# EAGLE design PulseOxi (EAGLE 9.6.2)
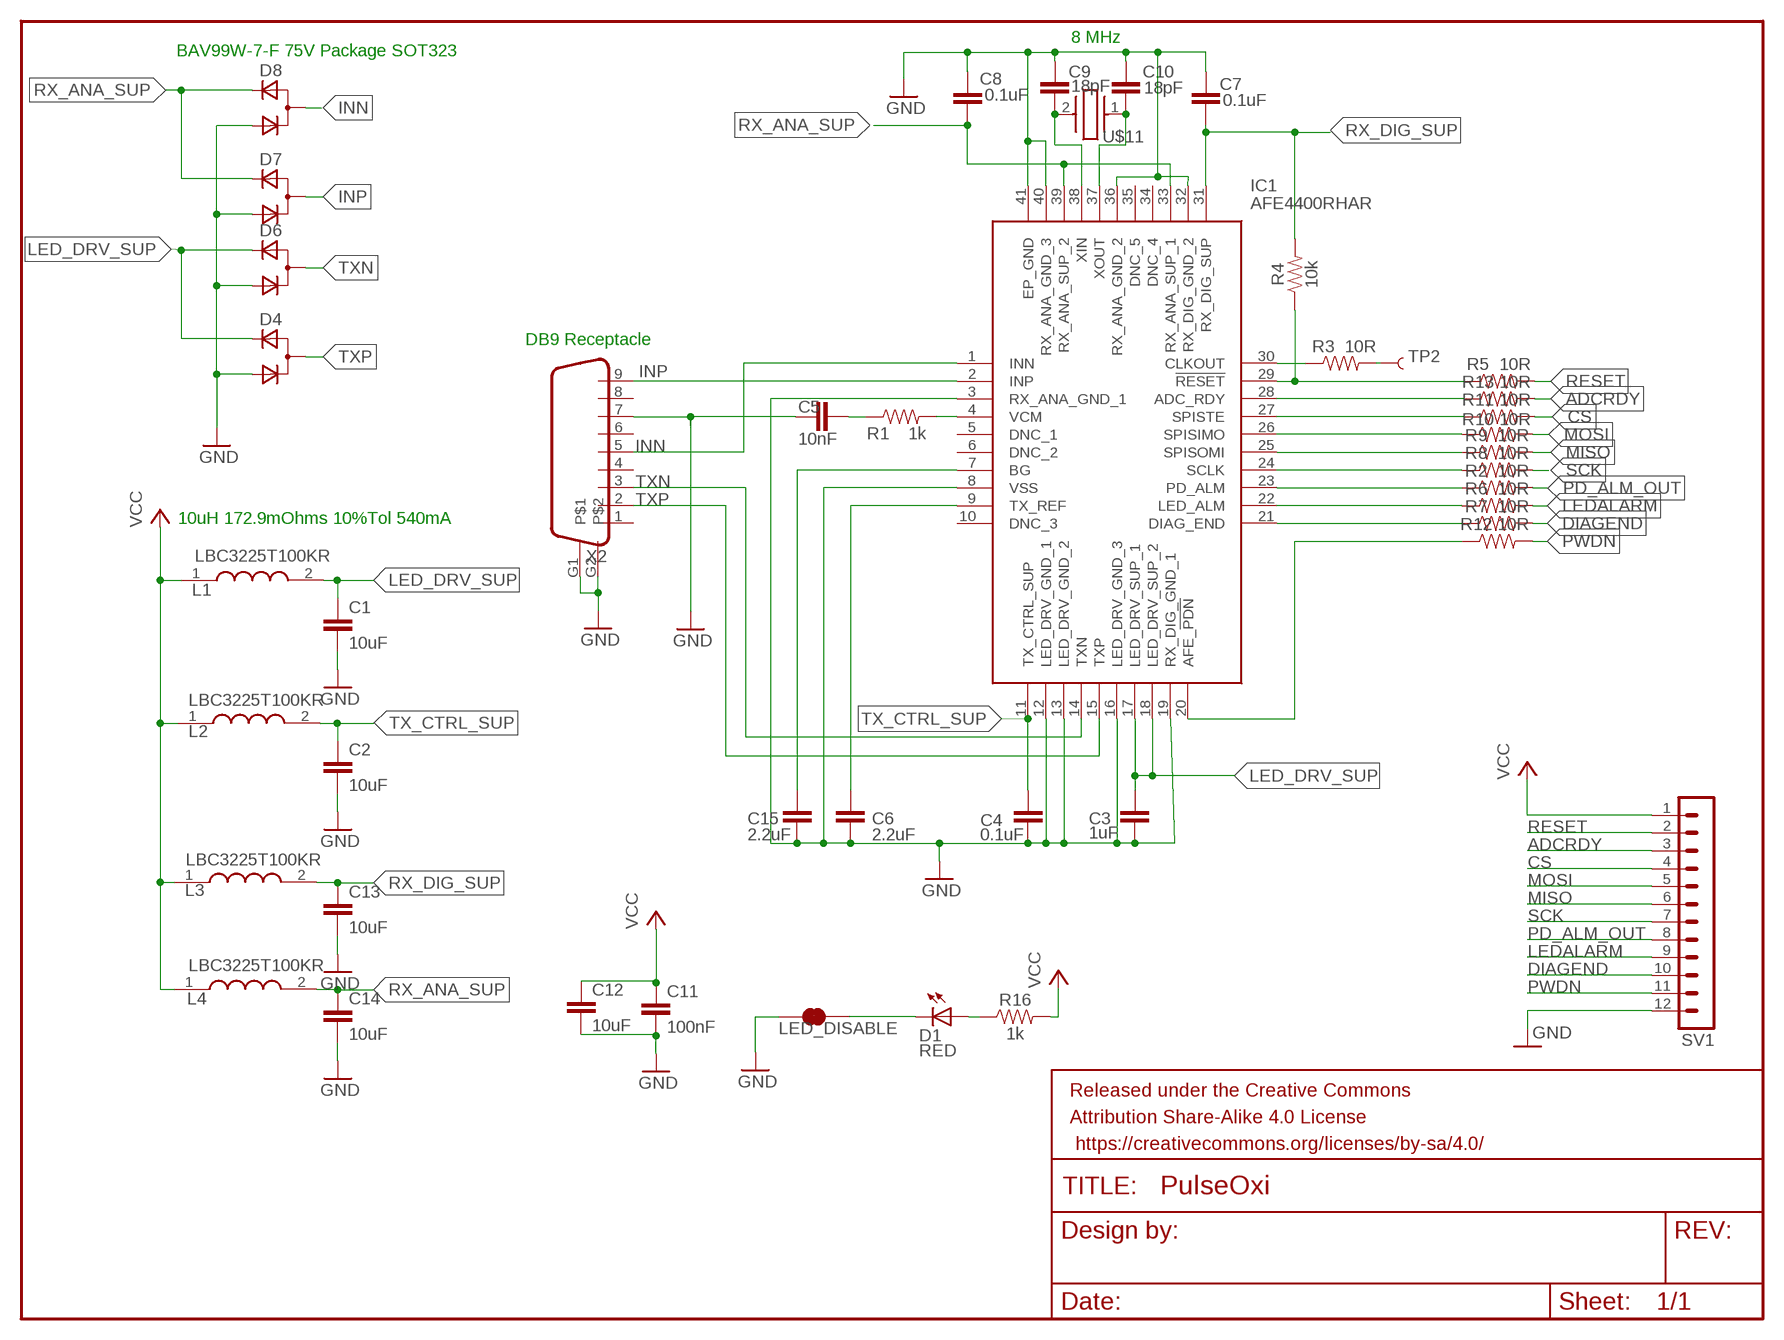
[diagram p0: schematic, sheet 1]

## Parts
C1  10uF  27PF-0603-50V-5%  [0603]
C2  10uF  27PF-0603-50V-5%  [0603]
C3  1uF  27PF-0603-50V-5%  [0603]
C4  0.1uF  27PF-0603-50V-5%  [0603]
C5  10nF  10NF-0603-50V-10%  [0603]
C6  2.2uF  27PF-0603-50V-5%  [0603]
C7  0.1uF  27PF-0603-50V-5%  [0603]
C8  0.1uF  27PF-0603-50V-5%  [0603]
C9  18pF  18PF-0603-50V-5%  [0603]
C10  18pF  18PF-0603-50V-5%  [0603]
C11  100nF  27PF-0603-50V-5%  [0603]
C12  10uF  27PF-0603-50V-5%  [0603]
C13  10uF  27PF-0603-50V-5%  [0603]
C14  10uF  27PF-0603-50V-5%  [0603]
C15  2.2uF  27PF-0603-50V-5%  [0603]
D1  RED  LED-RED0603  [LED-0603]
D4  D_ACACSOT323  [SOT323]
D6  D_ACACSOT323  [SOT323]
D7  D_ACACSOT323  [SOT323]
D8  D_ACACSOT323  [SOT323]
FRAME1  FRAME-LETTERNO_PACKAGE  [DUMMY]
IC1  AFE4400RHAR  [QFN50P600X600X100-41N]
L1  LBC3225T100KR  [INDC3225X270N]
L2  LBC3225T100KR  [INDC3225X270N]
L3  LBC3225T100KR  [INDC3225X270N]
L4  LBC3225T100KR  [INDC3225X270N]
LED_DISABLE  JUMPER-SMT_2_NC_TRACE_SILK  [SMT-JUMPER_2_NC_TRACE_SILK]
R1  1k  1KOHM-0603-1/10W-1%  [0603]
R2  10R  1.8MOHM  [0603]
R3  10R  1.8MOHM  [0603]
R4  10k  1.8MOHM  [0603]
R5  10R  1.8MOHM  [0603]
R6  10R  1.8MOHM  [0603]
R7  10R  1.8MOHM  [0603]
R8  10R  1.8MOHM  [0603]
R9  10R  1.8MOHM  [0603]
R10  10R  1.8MOHM  [0603]
R11  10R  1.8MOHM  [0603]
R12  10R  1.8MOHM  [0603]
R13  10R  1.8MOHM  [0603]
R16  1k  1KOHM-0603-1/10W-1%  [0603]
SV1  MA12-1  [MA12-1]
TP2  TEST-POINT3  [PAD.03X.03]
U$11  ABM3-8.000MHZ-D2Y-T  [ABM3]
X2  DB9  [DB9]

## Nets
ADCRDY: R13.2 SV1.3
AFE_PWDN: IC1.20(AFE_!PDN) R12.1
CS: R11.2 SV1.4
DIAGEND: R7.2 SV1.10
GND: C1.2 C2.2 C3.2 C4.2 C5.2 C6.2 C7.2 C8.2 C9.2 C10.2 C11.2 C12.2 C13.2 C14.2 C15.2 D4.2(C) D6.2(C) D7.2(C) D8.2(C) IC1.3(RX_ANA_GND_1) IC1.8(VSS) IC1.12(LED_DRV_GND_1) IC1.13(LED_DRV_GND_2) IC1.16(LED_DRV_GND_3) IC1.19(RX_DIG_GND_1) IC1.32(RX_DIG_GND_2) IC1.36(RX_ANA_GND_2) IC1.40(RX_ANA_GND_3) IC1.41(EP_GND) LED_DISABLE.1 SV1.12 X2.7 X2.G1 X2.G2
INN: D8.1(CA) IC1.1(INN) X2.5
INP: D7.1(CA) IC1.2(INP) X2.9
LED_DRV_SUP: C1.1 C3.1 D4.3(A) D6.3(A) IC1.17(LED_DRV_SUP_1) IC1.18(LED_DRV_SUP_2) L1.2
LEDALARM: R6.2 SV1.9
MISO: R9.2 SV1.6
MOSI: R10.2 SV1.5
N$1: R3.2 TP2.P$1
N$2: IC1.30(CLKOUT) R3.1
N$4: IC1.29(!RESET) R4.1 R5.1
N$5: C15.1 IC1.7(BG)
N$6: C5.1 R1.1
N$7: C6.1 IC1.9(TX_REF)
N$8: IC1.28(ADC_RDY) R13.1
N$9: IC1.21(DIAG_END) R7.1
N$10: IC1.22(LED_ALM) R6.1
N$11: IC1.23(PD_ALM) R2.1
N$12: IC1.24(SCLK) R8.1
N$13: IC1.25(SPISOMI) R9.1
N$14: IC1.26(SPISIMO) R10.1
N$15: IC1.27(SPISTE) R11.1
N$16: C9.1 IC1.38(XIN) U$11.2
N$17: IC1.4(VCM) R1.2
N$19: C10.1 IC1.37(XOUT) U$11.1
N$26: D1.A R16.1
N$28: D1.C LED_DISABLE.2
PD_ALM_OUT: R2.2 SV1.8
PWDN: R12.2 SV1.11
RESET: R5.2 SV1.2
RX_ANA_SUP: C8.1 C14.1 D7.3(A) D8.3(A) IC1.33(RX_ANA_SUP_1) IC1.39(RX_ANA_SUP_2) L4.2
RX_DIG_SUP: C7.1 C13.1 IC1.31(RX_DIG_SUP) L3.2 R4.2
SCK: R8.2 SV1.7
TX_CTRL_SUP: C2.1 C4.1 IC1.11(TX_CTRL_SUP) L2.2
TXN: D6.1(CA) IC1.14(TXN) X2.3
TXP: D4.1(CA) IC1.15(TXP) X2.2
VCC: C11.1 C12.1 L1.1 L2.1 L3.1 L4.1 R16.2 SV1.1
Unconnected: IC1.5(DNC_1) IC1.6(DNC_2) IC1.10(DNC_3) IC1.34(DNC_4) IC1.35(DNC_5) X2.1 X2.4 X2.6 X2.8

## Notes on the sheet
- 8 MHz
- BAV99W-7-F 75V Package SOT323
- DB9 Receptacle
- 10uH 172.9mOhms 10%Tol 540mA

## Library data of the parts
C1-C4 C6-C8 C11-C15 = SparkFun-Capacitors:27PF: 27pF ceramic capacitors A capacitor is a passive two-terminal electrical component used to store electrical energy temporarily in an electric field.; PROD_ID: CAP-09989; VALUE: 27pF
C5 = SparkFun-Capacitors:10NF: 0.01uF/10nF/10,000pF ceramic capacitors A capacitor is a passive two-terminal electrical component used to store electrical energy temporarily in an electric field. CAP-09321; PROD_ID: CAP-00867
C9 C10 = SparkFun-Capacitors:18PF: 18pF ceramic capacitors A capacitor is a passive two-terminal electrical component used to store electrical energy temporarily in an electric field.; PROD_ID: CAP-08267
D1 = SparkFun-LED:LED-RED: Assorted Red LEDs LilyPad 1206- DIO-09912 1206- DIO-00809 0603- DIO-00819; PROD_ID: DIO-00819
D4 D6-D8 = zetex:D_ACAC: Dual DIODE; OC_FARNELL: unknown; OC_NEWARK: unknown
FRAME1 = SparkFun-Aesthetics:FRAME-LETTER: Schematic Frame - Letter Standard 8.5x11 US Letter frame; DESIGNER: Nobody; VERSION: v01
IC1 = AFE4400RHAR:AFE4400RHAR: Integrated Analog Front End (AFE) for Heart-Rate Monitors and Low-Cost Pulse Oximeters Source: Datasheet <http://www.ti.com/lit/ds/symlink/afe4400.pdf>; DESCRIPTION: Integrated Analog Front End (AFE) for Heart-Rate Monitors and Low-Cost Pulse Oximeters; HEIGHT: 1mm; MANUFACTURER_NAME: Texas Instruments; MANUFACTURER_PART_NUMBER: AFE4400RHAR; MOUSER_PART_NUMBER: 595-AFE4400RHAR; MOUSER_PRICE-STOCK: https://www.mouser.co.uk/ProductDetail/Texas-Instruments/AFE4400RHAR?qs=MURVExHfc2zl%2FM9SqCv0pw%3D%3D
L1-L4 = LBC3225T100KR:LBC3225T100KR: TAIYO YUDEN - LBC3225T100KR - INDUCTOR, 10UH, 540MA, 10%, 23MHz Source: Datasheet <https://ds.yuden.co.jp/TYCOMPAS/ut/detail?pn=LBC3225T100KR &u=M>; DESCRIPTION: TAIYO YUDEN - LBC3225T100KR - INDUCTOR, 10UH, 540MA, 10%, 23MHz; HEIGHT: 2.7mm; MANUFACTURER_NAME: TAIYO YUDEN; MANUFACTURER_PART_NUMBER: LBC3225T100KR; MOUSER_PART_NUMBER: 963-LBC3225T100KR; MOUSER_PRICE-STOCK: https://www.mouser.co.uk/ProductDetail/TAIYO-YUDEN/LBC3225T100KR?qs=PzICbMaShUfZVMW%252BOICEZw%3D%3D
LED_DISABLE = SparkFun-Jumpers:JUMPER-SMT_2_NC_TRACE: Normally closed trace jumper This jumper has a trace between two pads so it's normally closed (NC). Use a razor knife to open the connection. For best results follow the IPC guidelines for cutting traces: Cutout at least 0.063 mm (0.005 in). Remove all loose material to clean up the cut area. Seal the cut with an approved epoxy. Reapply solder to reclose the connection.
R1 R16 = SparkFun-Resistors:1KOHM: 1kΩ resistor A resistor is a passive two-terminal electrical component that implements electrical resistance as a circuit element. Resistors act to reduce current flow, and, at the same time, act to lower voltage levels within circuits. - Wikipedia; PROD_ID: RES-07856
R2-R13 = SparkFun-Resistors:1.8MOHM: 1.8 MOhms ±5% 0.1W, 1/10W Chip Resistor 0603; PROD_ID: RES-13994; VALUE: 1.8M
SV1 = con-lstb:MA12-1: PIN HEADER; OC_FARNELL: unknown; OC_NEWARK: unknown
TP2 = SparkFun:TEST-POINT
U$11 = ABM3-8.000MHZ-D2Y-T:ABM3-8.000MHZ-D2Y-T: MEMS Crystal Oscillator 66.666MHz +/-50ppm 4-Pin SMD Bulk Source: Datasheet <https://abracon.com/Resonators/abm3.pdf>; DESCRIPTION: MEMS Crystal Oscillator 66.666MHz +/-50ppm 4-Pin SMD Bulk; HEIGHT: 1.3mm; MANUFACTURER_NAME: ABRACON; MANUFACTURER_PART_NUMBER: ABM3-8.000MHZ-D2Y-T; MOUSER_PART_NUMBER: 815-ABM3-8-D2Y-T; MOUSER_PRICE-STOCK: https://www.mouser.co.uk/ProductDetail/ABRACON/ABM3-8.000MHZ-D2Y-T?qs=ihRgKfnEsN4giUXjc3yS1g%3D%3D
X2 = circuitects:DB9: DB9 Connector Standard DB9 (D-Sub 9) serial connector. Can be used for CAN bus as well as RS485 and RS232. Footprint production proven. Spark Fun Electronics SKU : PRT-00429

## Board
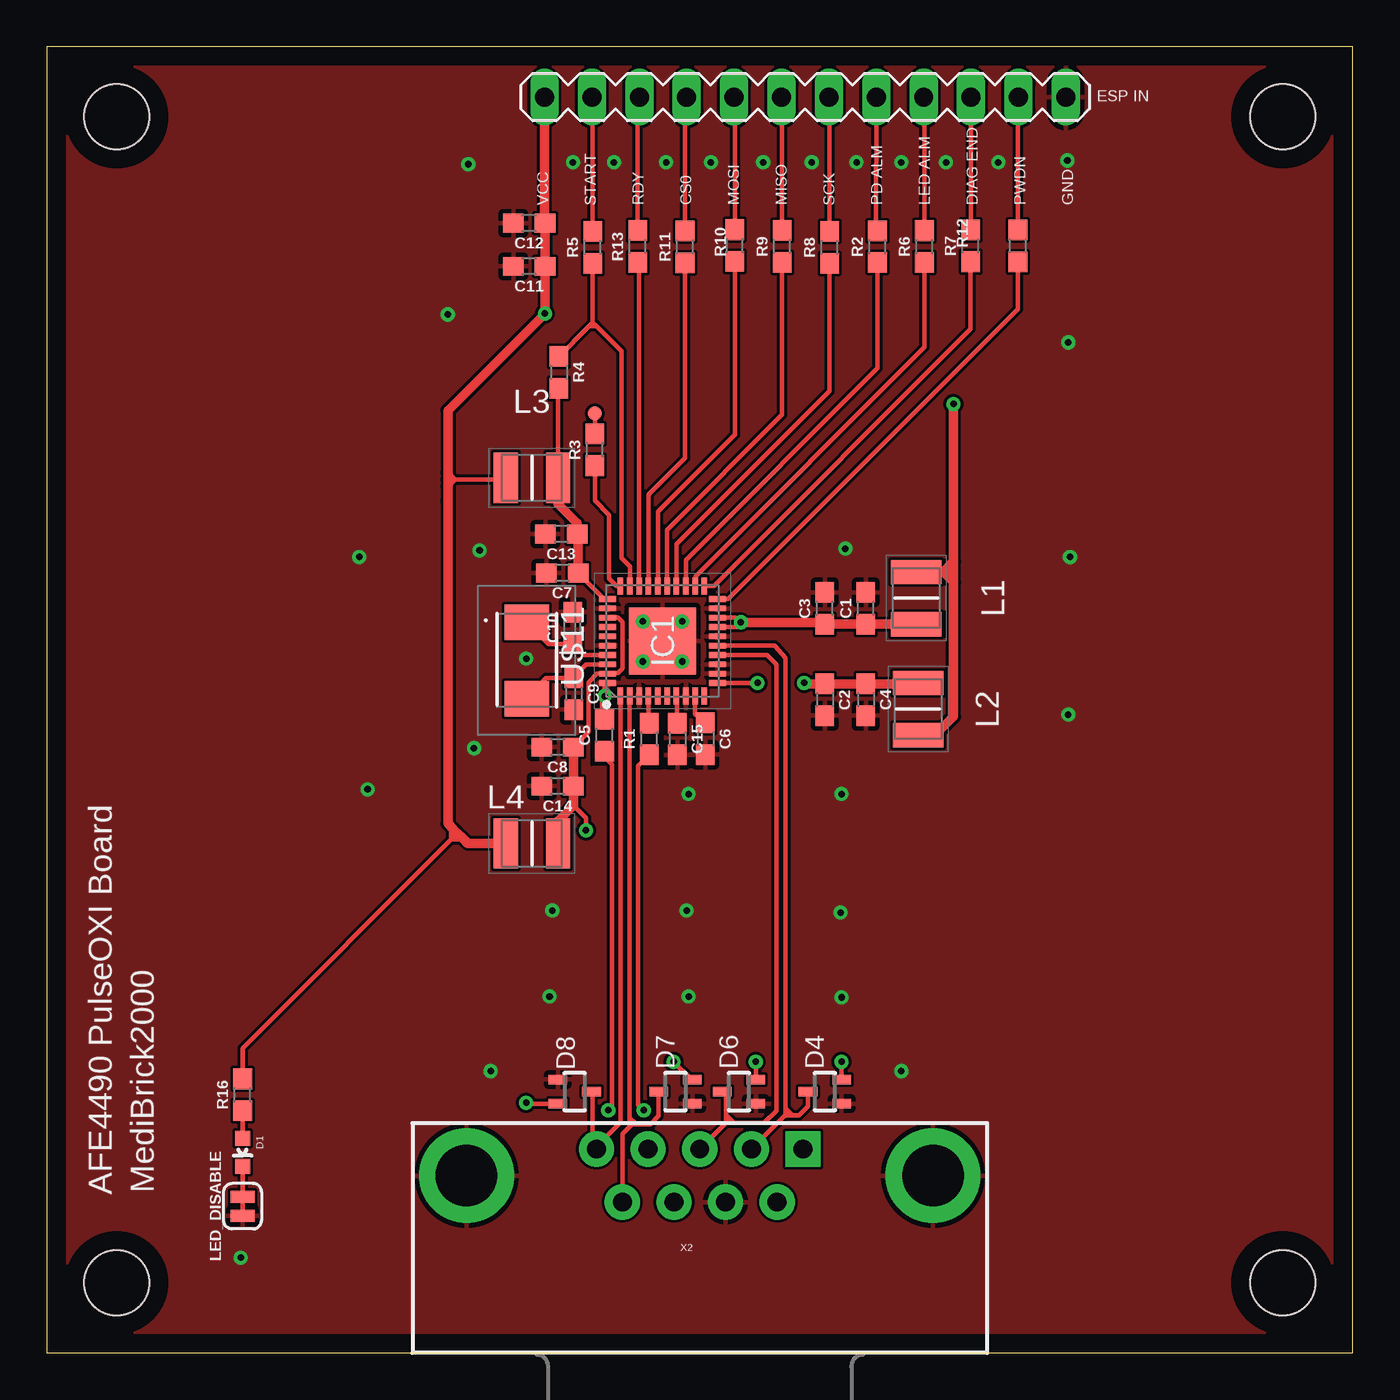
[diagram p1: board, top side]
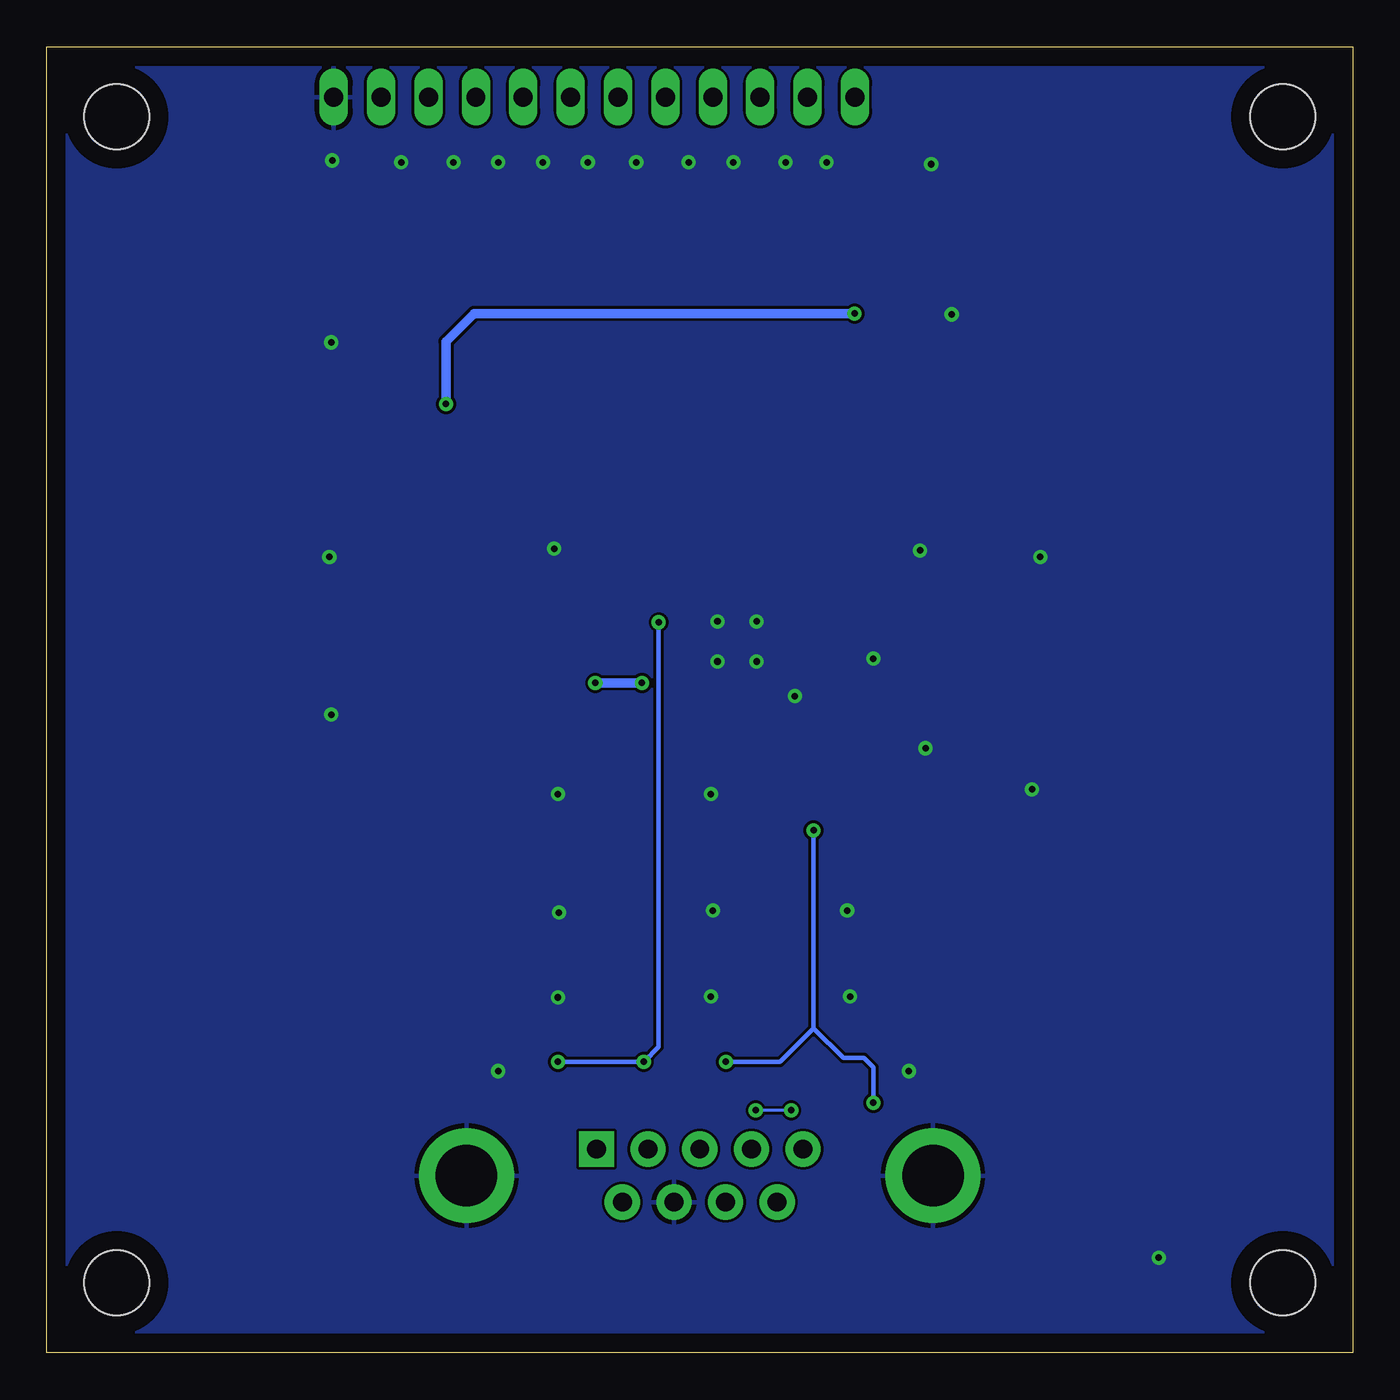
[diagram p2: board, bottom side, seen from below]

Size 70 x 70 mm. Coordinates in mm from the lower left corner, seen from the top.
Outline: 0,0 70,0 70,70 0,70 0,0
Copper layers (1*16): Top 0.035mm / dielectric 1.5mm / Bottom 0.035mm
Design rules "default": minimum track width 6mil, minimum drill 0.35mm, track to track 6mil, track to pad 6mil, pad to pad 6mil, via to via 6mil, smd to smd 6mil, copper to edge 40mil, drill to drill 6mil, minimum pad ring 10mil, minimum via ring 8mil, stop-mask expansion 4mil, vias tented up to drill 0mil, thermal gap 10mil
Holes 3.5 mm at 3.75,66.25 66.25,66.25 3.75,3.75 66.25,3.75

### Footprints (pad centres in the part's own frame; a part is rotated, then mirrored left to right if it is on the bottom)
0603 = smd 1.1 x 1: 1 -0.85,0; 2 0.85,0
LED-0603 = smd 0.8 x 0.8: A 0,-0.75; C 0,0.75
SOT323 = smd 0.5 x 1: 1 0,0.9; 2 -0.65,-0.9; 3 0.65,-0.9
QFN50P600X600X100-41N = smd 0.9 x 0.3: 1 -2.95,2.25; 2 -2.95,1.75; 3 -2.95,1.25; 4 -2.95,0.75; 5 -2.95,0.25; 6 -2.95,-0.25; 7 -2.95,-0.75; 8 -2.95,-1.25; 9 -2.95,-1.75; 10 -2.95,-2.25; 21 2.95,-2.25; 22 2.95,-1.75; 23 2.95,-1.25; 24 2.95,-0.75; 25 2.95,-0.25; 26 2.95,0.25; 27 2.95,0.75; 28 2.95,1.25; 29 2.95,1.75; 30 2.95,2.25 | smd 0.3 x 0.9: 11 -2.25,-2.95; 12 -1.75,-2.95; 13 -1.25,-2.95; 14 -0.75,-2.95; 15 -0.25,-2.95; 16 0.25,-2.95; 17 0.75,-2.95; 18 1.25,-2.95; 19 1.75,-2.95; 20 2.25,-2.95; 31 2.25,2.95; 32 1.75,2.95; 33 1.25,2.95; 34 0.75,2.95; 35 0.25,2.95; 36 -0.25,2.95; 37 -0.75,2.95; 38 -1.25,2.95; 39 -1.75,2.95; 40 -2.25,2.95 | smd 3.607 x 3.607: 41 0,0
INDC3225X270N = smd 1.3 x 2.7: 1 -1.4,0; 2 1.4,0
SMT-JUMPER_2_NC_TRACE_SILK = smd 0.635 x 1.27: 1 -0.508,0; 2 0.508,0
MA12-1 = drill 1.016 long: 1 -13.97,0; 2 -11.43,0; 3 -8.89,0; 4 -6.35,0; 5 -3.81,0; 6 -1.27,0; 7 1.27,0; 8 3.81,0; 9 6.35,0; 10 8.89,0; 11 11.43,0; 12 13.97,0
PAD.03X.03 = smd 0.762 x 0.762: P$1 0,0
ABM3 = smd 1.9 x 2.4: 1 -2.05,0; 2 2.05,0
DB9 = drill 1.016 pad 1.88 square: 1 -5.54,-1.42 | drill 1.016 pad 1.88: 2 -2.77,-1.42; 3 0,-1.42; 4 2.77,-1.42; 5 5.54,-1.42; 6 -4.15,1.42; 7 -1.38,1.42; 8 1.38,1.42; 9 4.15,1.42 | drill 3.302 pad 5.08: G1 -12.5,0; G2 12.5,0

### Placement (x,y rotation side)
C1  43.9,39.9 90 top
C2  41.7,35 270 top
C3  41.7,39.9 90 top
C4  43.9,35 270 top
C5  29.9,33.1 90 top
C6  35.3,32.91 270 top
C7  27.63,41.79 180 top
C8  27.38,32.46 180 top
C9  28.24,35.32 270 top
C10  28.2,38.84 90 top
C11  25.86,58.23 180 top
C12  25.86,60.54 180 top
C13  27.58,43.88 180 top
C14  27.38,30.37 180 top
C15  33.8,32.9 270 top
D1  10.5,10.75 180 top
D4  41.7,14 90 top
D6  37.1,14 90 top
D7  33.7,14 90 top
D8  28.3,14 270 top
FRAME1  28.3,35.25 179.6 top
IC1  33,38.15 90 top
L1  46.6,40.45 270 top
L2  46.7,34.5 90 top
L3  26,46.9 0 top
L4  26,27.3 0 top
LED_DISABLE  10.5,7.86 90 top
R1  32.3,32.9 90 top
R2  44.52,59.28 90 top
R3  29.38,48.4 90 top
R4  27.45,52.55 270 top
R5  29.26,59.24 90 top
R6  47.04,59.29 90 top
R7  49.51,59.33 90 top
R8  41.96,59.24 90 top
R9  39.42,59.29 90 top
R10  36.88,59.34 90 top
R11  34.21,59.27 90 top
R12  52.05,59.32 90 top
R13  31.67,59.3 90 top
R16  10.5,13.83 90 top
SV1  40.65,67.3 0 top
TP2  29.38,50.34 0 top
U$11  25.73,37.11 270 top
X2  35,9.5 180 top

### Tracks (layer width: path | path; a pad name or v marks a point on that pad's centre or on a via)
ADCRDY
  Top 0.254: R13.2 31.67,67.21 SV1.3
AFE_PWDN
  Top 0.254: IC1.20 36.5,40.4 52.05,55.95 R12.1
CS
  Top 0.254: R11.2 34.21,67.21 SV1.4
DIAGEND
  Top 0.254: SV1.10 49.54,60.21 R7.2
GND  (via drill 0.35)
  Top 0.152: IC1.41 33.95,39.1 34,39.1 | IC1.41 v31.95,39.2 | 33,38.1 v31.95,37.05 | IC1.41 33,38.1 | 33,38.1 v34.05,37.05
  Top 0.254: 34.23,35.22 IC1.8 | v29.9,35.2 29.9,35.75
  Top 0.508: C5.2 v29.9,35.2
  other vias: 23.2,43 22.9,32.4 25.7,37.2 42.55,23.6 42.6,29.95 42.8,43.1 54.85,42.65 54.75,34.2 54.75,54.15 54.7,63.9 51,63.8 48.2,63.8 45.8,63.8 43.4,63.8 41,63.8 38.4,63.8 35.6,63.8 33.2,63.8 30.4,63.8 28.2,63.8 22.6,63.7 42.6,19.05 45.8,15.1 23.8,15.1 26.95,19.1 27.1,23.7 10.4,5.1 34.05,39.2 34.4,19.1 34.3,23.7 34.4,29.95 17.2,30.2 16.75,42.65 21.5,55.65
  pour Top: 0,70 0,0 69.85,0 69.85,69.85
  pour Bottom: 0,70 0,0 0.6,0 69.85,0 69.85,69.85
  cutout Top: 31.55,34.5 33,34.5 33,31.3 31.55,31.3
  cutout Top: 29.2,35.5 30.6,35.5 30.6,31.5 29.2,31.5
INN
  Top 0.254: D8.1 29.25,13.95 29.25,11.13 X2.5 29.46,10.94 29.57,11.17 30.76,12.36 IC1.1
INP
  Top 0.254: D7.1 32.8,12.7 32.35,12.25 31.55,12.25 | X2.9 30.85,11.72 31.24,12.11 | 31.24,12.11 31.24,12.6 | 31.24,12.11 31.38,12.25 31.55,12.25 | 31.24,12.6 31.55,12.29 31.55,12.25 | IC1.2 31.24,35.19 31.24,12.6
LED_DRV_SUP  (via drill 0.35)
  Top 0.254: D6.3 v38,15.6 | D4.3 v42.6,15.6 | IC1.18 36.91,39.4 v37.2,39.15 37.01,38.9 IC1.17
  Top 0.508: L1.2 C1.1 C3.1 41.6,39.15 v37.2,39.15
  Bottom 0.254: v42.6,15.6 v38,15.6 37.2,16.4 v37.2,39.15
LEDALARM
  Top 0.254: R6.2 47.04,67.26 SV1.9
MISO
  Top 0.254: R9.2 39.42,67.26 SV1.6
MOSI
  Top 0.254: R10.2 36.88,67.26 SV1.5
N$1
  Top 0.254: R3.2 TP2.P$1
N$2
  Top 0.254: R3.1 29.38,45.67 30.15,44.9 30.15,41.5 30.55,41.1 IC1.30
N$4
  Top 0.254: IC1.29 31.25,42.15 30.8,42.6 30.8,53.68 29.46,55.01 | 29.46,55.01 29.26,55.22 | R5.1 29.26,55.22 | R4.1 29.02,54.98 29.06,55.01 | 29.06,55.01 29.26,55.21 29.26,55.22 | 29.06,55.01 29.46,55.01
N$5
  Top 0.254: C15.1 IC1.7
N$6  (via drill 0.35)
  Top 0.254: R1.1 31.7,31.45 31.7,13.3 v32,13 | v30.1,13 30.3,13.2 30.3,31.53 29.9,31.95 C5.1
  Bottom 0.152: v30.1,13 v32,13
N$7
  Top 0.254: C6.1 34.75,34.23 IC1.9
N$8
  Top 0.254: IC1.28 31.75,58.37 R13.1
N$9
  Top 0.254: R7.1 49.51,54.86 35.75,41.1 IC1.21
N$10
  Top 0.254: IC1.22 34.77,41.12 34.77,41.62 47.04,53.89 R6.1
N$11
  Top 0.254: R2.1 44.52,52.77 34.25,42.5 IC1.23
N$12
  Top 0.254: R8.1 41.96,51.66 41.95,51.65 41.95,51.55 33.75,43.35 IC1.24
N$13
  Top 0.254: IC1.25 33.25,44.1 39.42,50.27 R9.1
N$14
  Top 0.254: R10.1 36.88,49.21 32.75,45.08 IC1.26
N$15
  Top 0.254: R11.1 34.21,47.96 32.25,46 IC1.27
N$16
  Top 0.254: U$11.2 25.73,35.13 26.77,36.17 C9.1 28.24,36.24 28.9,36.9 IC1.38
N$17
  Top 0.254: IC1.4 32.25,33.8 R1.2
N$19
  Top 0.254: U$11.1 26.9,37.99 C10.1 28.79,37.4 IC1.37
N$26
  Top 0.254: D1.A R16.1
N$28
  Top 0.254: LED_DISABLE.2 D1.C
PD_ALM_OUT
  Top 0.254: SV1.8 44.45,60.2 R2.2
PWDN
  Top 0.254: R12.2 52.05,67.27 SV1.11
RESET
  Top 0.254: R5.2 29.26,67.26 SV1.2
RX_ANA_SUP  (via drill 0.35)
  Top 0.254: D8.3 25.75,13.35 v25.7,13.4 | D7.3 34.55,14.65 v33.6,15.6 | C8.1 29.03,33.26 29.03,35.93 29.5,36.4 IC1.39 30.07,36.42 30.62,36.42 30.85,36.68 30.85,39.17 30.63,39.41 IC1.33 | 28.23,29.33 28.9,28.66 v28.9,28
  Top 0.508: C8.1 C14.1 28.23,29.33 27.4,28.5 L4.2
  Bottom 0.254: v28.9,28 28.9,17.4 | 28.9,17.4 27.3,15.8 26.2,15.8 25.7,15.3 v25.7,13.4 | v33.6,15.6 30.7,15.6 28.9,17.4
RX_DIG_SUP
  Top 0.254: R4.2 27.4,51.41 L3.2 | IC1.31 29.87,40.4 C7.1
  Top 0.508: C7.1 28.48,43.83 C13.1 28.43,44.47 27.4,45.5 L3.2
SCK
  Top 0.254: R8.2 41.96,67.26 SV1.7
TX_CTRL_SUP  (via drill 0.35)
  Top 0.254: v38.1,35.9 IC1.11
  Top 0.508: v40.6,35.9 40.65,35.85 C2.1 C4.1 46.65,35.85 L2.2
  Bottom 0.508: v38.1,35.9 v40.6,35.9
TXN
  Top 0.254: 36.4,12.32 36.83,12.32 | X2.3 36.4,12.32 | 36.4,12.32 36.4,12.75 | 36.4,12.75 36.4,13.8 D6.1 | IC1.14 38.6,37.4 39.1,36.9 39.1,12.97 38.45,12.32 36.85,12.32 36.83,12.32 | 36.4,12.75 36.83,12.32
TXP
  Top 0.254: IC1.15 39,37.9 39.05,37.85 39.6,37.23 39.6,13.1 | 39.97,12.73 39.58,12.73 X2.2 | D4.1 40.8,13.22 40.31,12.73 40,12.73 39.97,12.73 | 39.6,13.1 39.6,12.75 | 39.6,13.1 39.97,12.73
VCC  (via drill 0.35)
  Top 0.254: R16.2 10.5,16.33 21.69,27.51 | L3.1 24.5,46.8 21.9,46.8 | 21.9,46.8 21.5,46.8 | 21.9,46.8 21.5,47.2 | 21.9,46.8 21.5,46.4 | 21.69,27.51 22.02,27.85 | 21.69,27.51 21.69,27.99 21.78,28.08 | 21.69,27.51 22.31,27.51 22.33,27.53 | 21.5,45.7 21.5,45.6
  Top 0.508: 21.5,45.6 21.5,28.36 21.78,28.08 22.02,27.85 22.33,27.53 22.56,27.3 L4.1 | SV1.1 26.67,60.58 C12.1 C11.1 v26.71,55.71 v26.7,55.7 21.5,50.5 21.5,47.2 21.5,46.8 21.5,46.4 21.5,45.7 | 48.05,41.85 48.6,42.4 | 48.6,41.3 48.6,34.1 47.6,33.1 L2.1 | L1.1 48.05,41.85 | 48.05,41.85 48.6,41.3 | 48.6,42.4 v48.6,50.85 | 48.6,41.3 48.6,42.4
  Bottom 0.508: v26.7,55.7 47.1,55.7 48.6,54.2 v48.6,50.85

### Text on the board
tNames: ESP IN | VCC | START | RDY | CS0 | MOSI | MISO | SCK | PD ALM | LED ALM | DIAG END | PWDN | GND | MediBrick2000 | AFE4490 PulseOXI Board